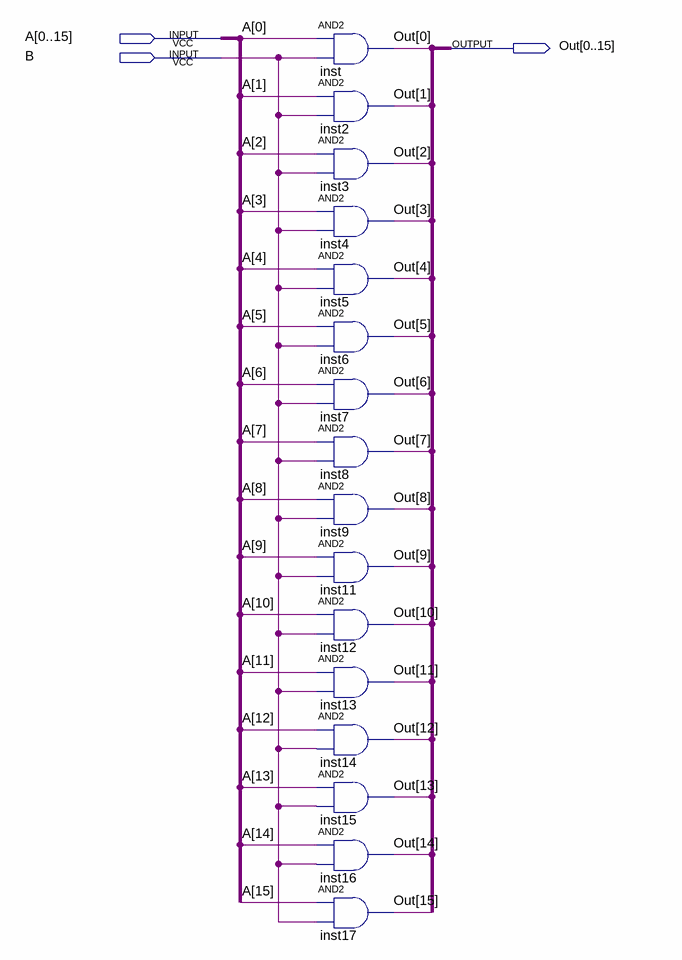
[diagram p0: schematic sheet]
// Quartus schematic and_bus16.bdf as structural Verilog: 16 symbols, 3 pins
module and_bus16 (
  input  [0:15] A,
  input  B,
  output [0:15] Out
);

  and inst (Out[0], A[0], B);
  and inst2 (Out[1], A[1], B);
  and inst3 (Out[2], A[2], B);
  and inst4 (Out[3], A[3], B);
  and inst5 (Out[4], A[4], B);
  and inst6 (Out[5], A[5], B);
  and inst7 (Out[6], A[6], B);
  and inst8 (Out[7], A[7], B);
  and inst9 (Out[8], A[8], B);
  and inst11 (Out[9], A[9], B);
  and inst12 (Out[10], A[10], B);
  and inst13 (Out[11], A[11], B);
  and inst14 (Out[12], A[12], B);
  and inst15 (Out[13], A[13], B);
  and inst16 (Out[14], A[14], B);
  and inst17 (Out[15], A[15], B);
endmodule
